# EAGLE design EnigmaMon (EAGLE 6.1)
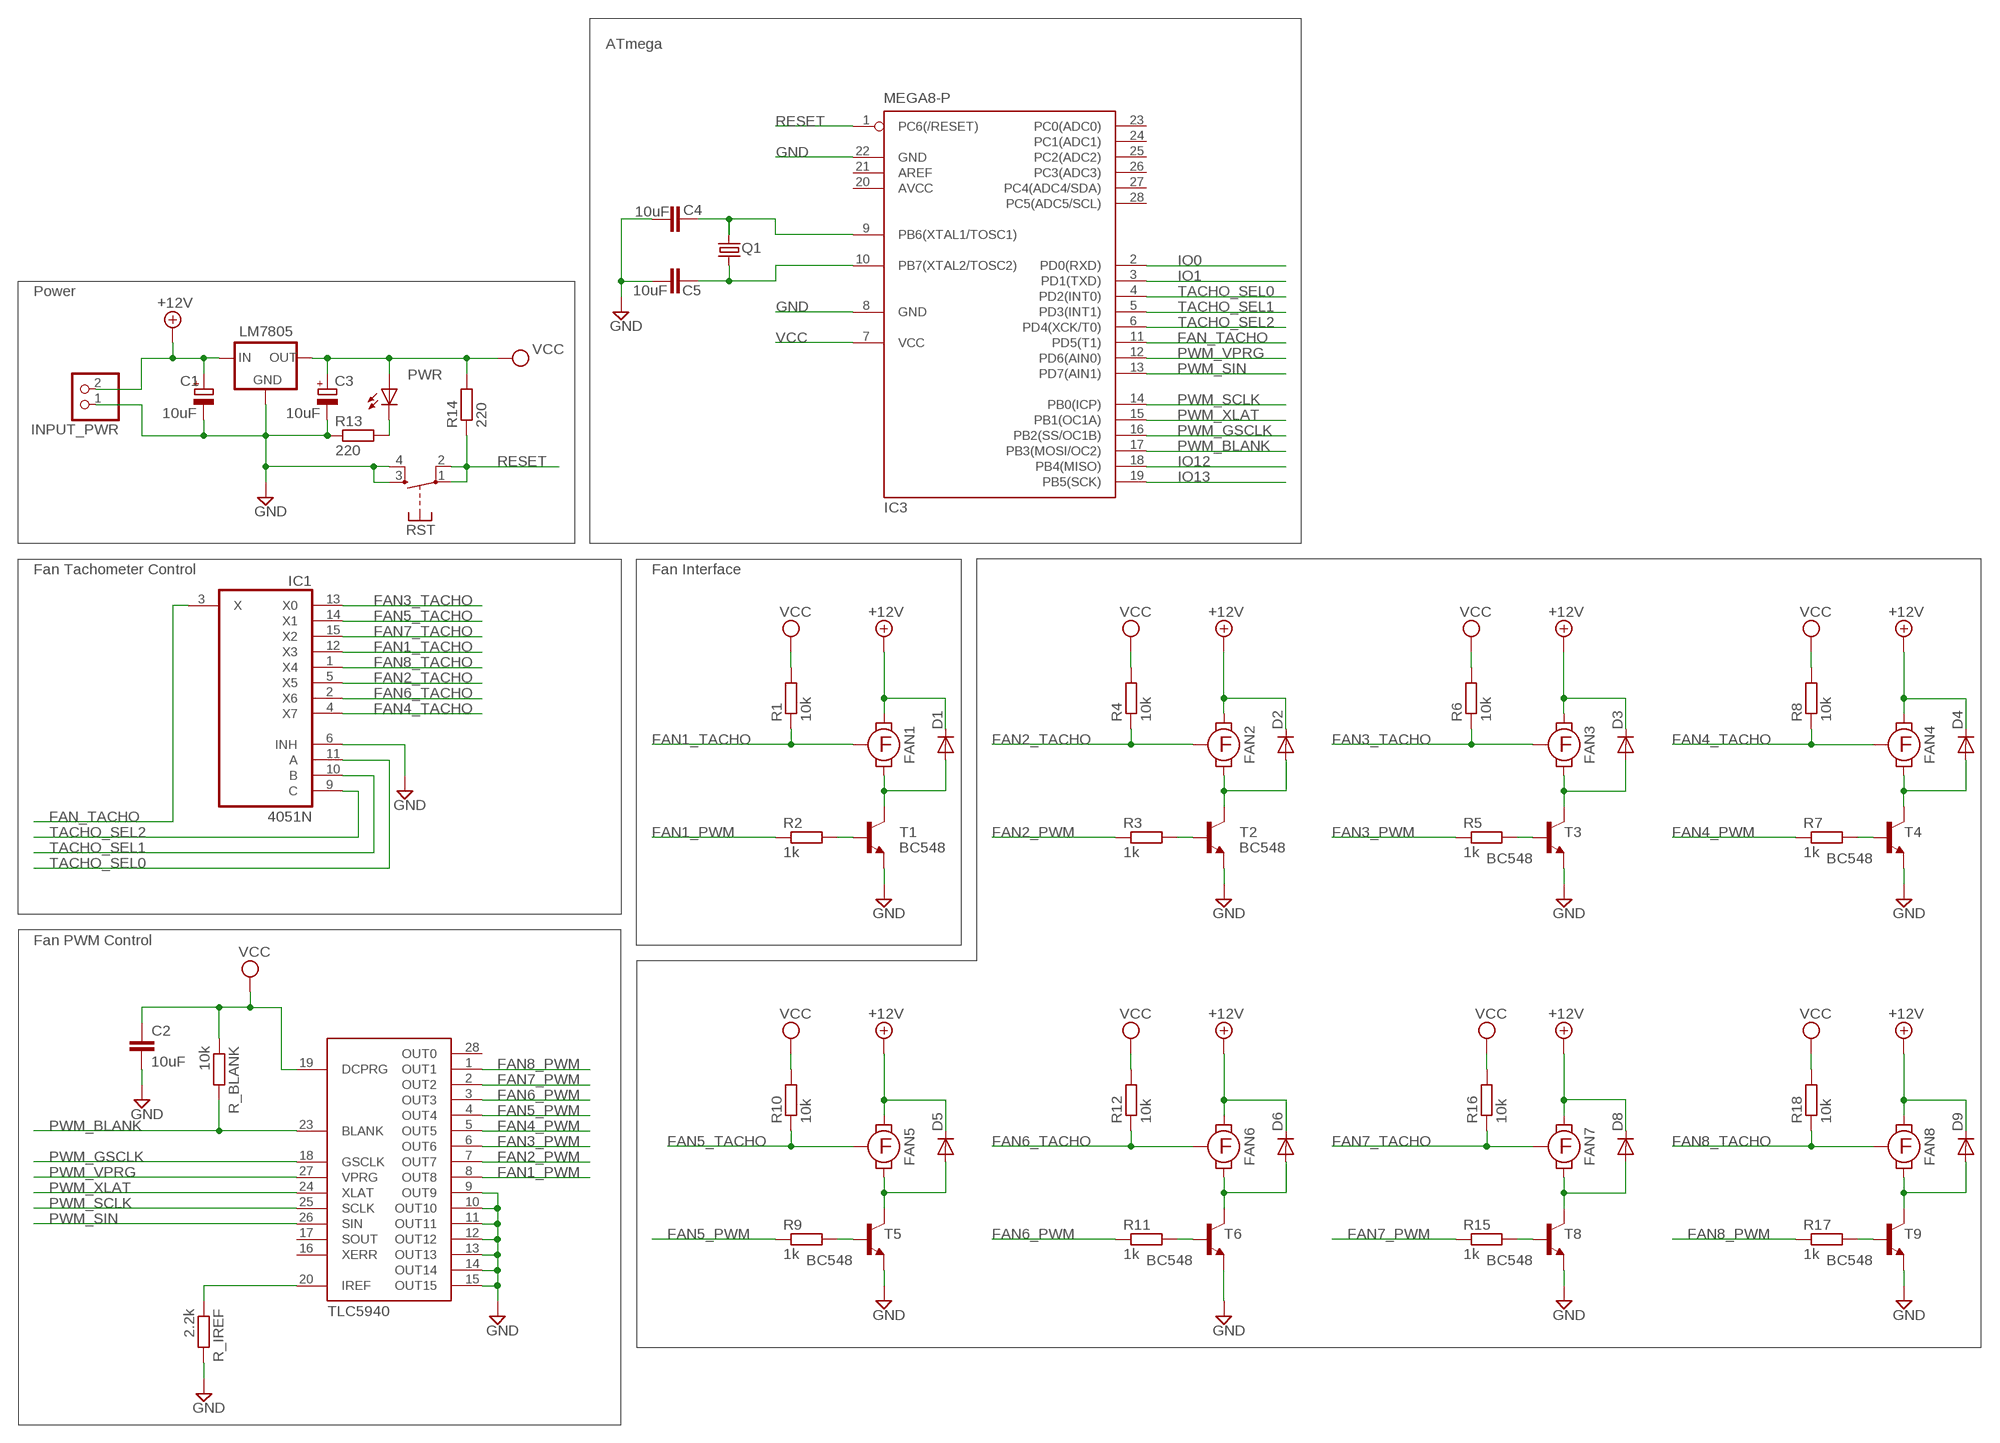
[diagram p0: schematic, sheet 1]

## Parts
C1  10uF  CPOL-EUE2.5-6  [E2,5-6]
C2  10uF  C-EU025-025X050  [C025-025X050]
C3  10uF  CPOL-EUE2.5-6  [E2,5-6]
C4  10uF  C-EU025-025X050  [C025-025X050]
C5  10uF  C-EU025-025X050  [C025-025X050]
D1  DIODE-D-5  [D-5]
D2  DIODE-D-5  [D-5]
D3  DIODE-D-5  [D-5]
D4  DIODE-D-5  [D-5]
D5  DIODE-D-5  [D-5]
D6  DIODE-D-5  [D-5]
D8  DIODE-D-5  [D-5]
D9  DIODE-D-5  [D-5]
FAN1  FAN  [FAN_HEADER]
FAN2  FAN  [FAN_HEADER]
FAN3  FAN  [FAN_HEADER]
FAN4  FAN  [FAN_HEADER]
FAN5  FAN  [FAN_HEADER]
FAN6  FAN  [FAN_HEADER]
FAN7  FAN  [FAN_HEADER]
FAN8  FAN  [FAN_HEADER]
IC1  4051N  [DIL16]
IC2  TLC5940  [DIL28-3]
IC3  MEGA8-P  [DIL28-3]
INPUT_PWR  PINHD-1X2  [1X02]
LM7805  78XXL  [78XXL]
PWR  LED3MM  [LED3MM]
Q1  CRYSTALHC49S  [HC49/S]
R1  10k  R-EU_0204/5  [0204/5]
R2  1k  R-EU_0204/5  [0204/5]
R3  1k  R-EU_0204/5  [0204/5]
R4  10k  R-EU_0204/5  [0204/5]
R5  1k  R-EU_0204/5  [0204/5]
R6  10k  R-EU_0204/5  [0204/5]
R7  1k  R-EU_0204/5  [0204/5]
R8  10k  R-EU_0204/5  [0204/5]
R9  1k  R-EU_0204/5  [0204/5]
R10  10k  R-EU_0204/5  [0204/5]
R11  1k  R-EU_0204/5  [0204/5]
R12  10k  R-EU_0204/5  [0204/5]
R13  220  R-EU_0204/7  [0204/7]
R14  220  R-EU_0204/7  [0204/7]
R15  1k  R-EU_0204/5  [0204/5]
R16  10k  R-EU_0204/5  [0204/5]
R17  1k  R-EU_0204/5  [0204/5]
R18  10k  R-EU_0204/5  [0204/5]
R_BLANK  10k  R-EU_0204/7  [0204/7]
R_IREF  2.2k  R-EU_0204/7  [0204/7]
RST  DTS6  [DTS6]
T1  BC548  BC547  [TO92]
T2  BC548  BC547  [TO92]
T3  BC548  BC547  [TO92]
T4  BC548  BC547  [TO92]
T5  BC548  BC547  [TO92]
T6  BC548  BC547  [TO92]
T8  BC548  BC547  [TO92]
T9  BC548  BC547  [TO92]

## Nets
+12V: C1.+ D1.C D2.C D3.C D4.C D5.C D6.C D8.C D9.C FAN1.VCC FAN2.VCC FAN3.VCC FAN4.VCC FAN5.VCC FAN6.VCC FAN7.VCC FAN8.VCC INPUT_PWR.2 LM7805.IN
FAN1_PWM: IC2.8(OUT8) R2.1
FAN1_TACHO: FAN1.TACHO IC1.12(X3) R1.1
FAN2_PWM: IC2.7(OUT7) R3.1
FAN2_TACHO: FAN2.TACHO IC1.5(X5) R4.1
FAN3_PWM: IC2.6(OUT6) R5.1
FAN3_TACHO: FAN3.TACHO IC1.13(X0) R6.1
FAN4_PWM: IC2.5(OUT5) R7.1
FAN4_TACHO: FAN4.TACHO IC1.4(X7) R8.1
FAN5_PWM: IC2.4(OUT4) R9.1
FAN5_TACHO: FAN5.TACHO IC1.14(X1) R10.1
FAN6_PWM: IC2.3(OUT3) R11.1
FAN6_TACHO: FAN6.TACHO IC1.2(X6) R12.1
FAN7_PWM: IC2.2(OUT2) R15.1
FAN7_TACHO: FAN7.TACHO IC1.15(X2) R16.1
FAN8_PWM: IC2.1(OUT1) R17.1
FAN8_TACHO: FAN8.TACHO IC1.1(X4) R18.1
FAN_TACHO: IC1.3(X) IC3.11(PD5(T1))
GND: C1.- C2.2 C3.- C4.1 C5.1 IC1.6(INH) IC2.9(OUT9) IC2.10(OUT10) IC2.11(OUT11) IC2.12(OUT12) IC2.13(OUT13) IC2.14(OUT14) IC2.15(OUT15) IC3.8(GND) IC3.22(GND) INPUT_PWR.1 LM7805.GND R13.1 R_IREF.2 RST.3(S) RST.4(S) T1.1(E) T2.1(E) T3.1(E) T4.1(E) T5.1(E) T6.1(E) T8.1(E) T9.1(E)
IO0: IC3.2(PD0(RXD))
IO1: IC3.3(PD1(TXD))
IO12: IC3.18(PB4(MISO))
IO13: IC3.19(PB5(SCK))
N$1: R3.2 T2.2(B)
N$2: R2.2 T1.2(B)
N$3: R5.2 T3.2(B)
N$4: R7.2 T4.2(B)
N$5: R9.2 T5.2(B)
N$6: R11.2 T6.2(B)
N$7: PWR.K(C) R13.2
N$8: R15.2 T8.2(B)
N$9: R17.2 T9.2(B)
N$10: IC2.20(IREF) R_IREF.1
N$11: C4.2 IC3.9(PB6(XTAL1/TOSC1)) Q1.2
N$12: C5.2 IC3.10(PB7(XTAL2/TOSC2)) Q1.1
N$13: D2.A FAN2.GND T2.3(C)
N$14: D3.A FAN3.GND T3.3(C)
N$15: D4.A FAN4.GND T4.3(C)
N$16: D1.A FAN1.GND T1.3(C)
N$17: D9.A FAN8.GND T9.3(C)
N$19: D8.A FAN7.GND T8.3(C)
N$20: D6.A FAN6.GND T6.3(C)
N$21: D5.A FAN5.GND T5.3(C)
PWM_BLANK: IC2.23(BLANK) IC3.17(PB3(MOSI/OC2)) R_BLANK.2
PWM_GSCLK: IC2.18(GSCLK) IC3.16(PB2(SS/OC1B))
PWM_SCLK: IC2.25(SCLK) IC3.14(PB0(ICP))
PWM_SIN: IC2.26(SIN) IC3.13(PD7(AIN1))
PWM_VPRG: IC2.27(VPRG) IC3.12(PD6(AIN0))
PWM_XLAT: IC2.24(XLAT) IC3.15(PB1(OC1A))
RESET: IC3.1(PC6(/RESET)) R14.1 RST.1(P) RST.2(P)
TACHO_SEL0: IC1.11(A) IC3.4(PD2(INT0))
TACHO_SEL1: IC1.10(B) IC3.5(PD3(INT1))
TACHO_SEL2: IC1.9(C) IC3.6(PD4(XCK/T0))
VCC: C2.1 C3.+ IC2.19(DCPRG) IC3.7(VCC) LM7805.OUT PWR.A R1.2 R4.2 R6.2 R8.2 R10.2 R12.2 R14.2 R16.2 R18.2 R_BLANK.1
Unconnected: IC2.16(XERR) IC2.17(SOUT) IC2.28(OUT0) IC3.21(AREF) IC3.23(PC0(ADC0)) IC3.24(PC1(ADC1)) IC3.25(PC2(ADC2)) IC3.26(PC3(ADC3)) IC3.27(PC4(ADC4/SDA)) IC3.28(PC5(ADC5/SCL))

## Notes on the sheet
- ATmega
- Power
- Fan Tachometer Control | Fan Interface
- Fan PWM Control

## Power pins joined to a net without a drawn wire
AVCC: IC3.20(AVCC)
GND: IC1.8(GND) IC2.22(GND)
VCC: IC1.16(VCC) IC2.21(VCC)
VEE: IC1.7(VEE)

## Library data of the parts
C1 C3 = rcl:CPOL-EU: POLARIZED CAPACITOR, European symbol
C2 C4 C5 = rcl:C-EU: CAPACITOR, European symbol
D1-D6 D8 D9 = diode:DIODE-: DIODE
FAN1-FAN8 = EnigmaMon:FAN
IC1 = 40xx:4051: 8-channel ANALOG MULTIPLEXER
IC2 = EnigmaMon:TLC5940: 16-channel LED driver with dot-correction and grayscale PWM control
IC3 = EnigmaMon:MEGA8-P: MICROCONTROLLER 8 Kbytes FLASH, 1 kbytes SRAM, 512 bytes EEPROM, USART, 4-channel 10 bit ADC, 2-channel 8 bit ADC Pin compatible with Atmega48, ATMega88, ATMega168 Source: avr.lbr; OC_FARNELL: unknown; OC_NEWARK: unknown
INPUT_PWR = EnigmaMon:PINHD-1X2: PIN HEADER
LM7805 = EnigmaMon:78XXL: VOLTAGE REGULATOR
PWR = EnigmaMon:LED: LED
Q1 = EnigmaMon:CRYSTAL: CRYSTAL; OC_FARNELL: 1667008; OC_NEWARK: unknown
R1-R18 R_BLANK R_IREF = rcl:R-EU_: RESISTOR, European symbol
RST = EnigmaMon:DTS6
T1-T6 T8 T9 = transistor:BC547: NPN TRANSISTOR

## Board
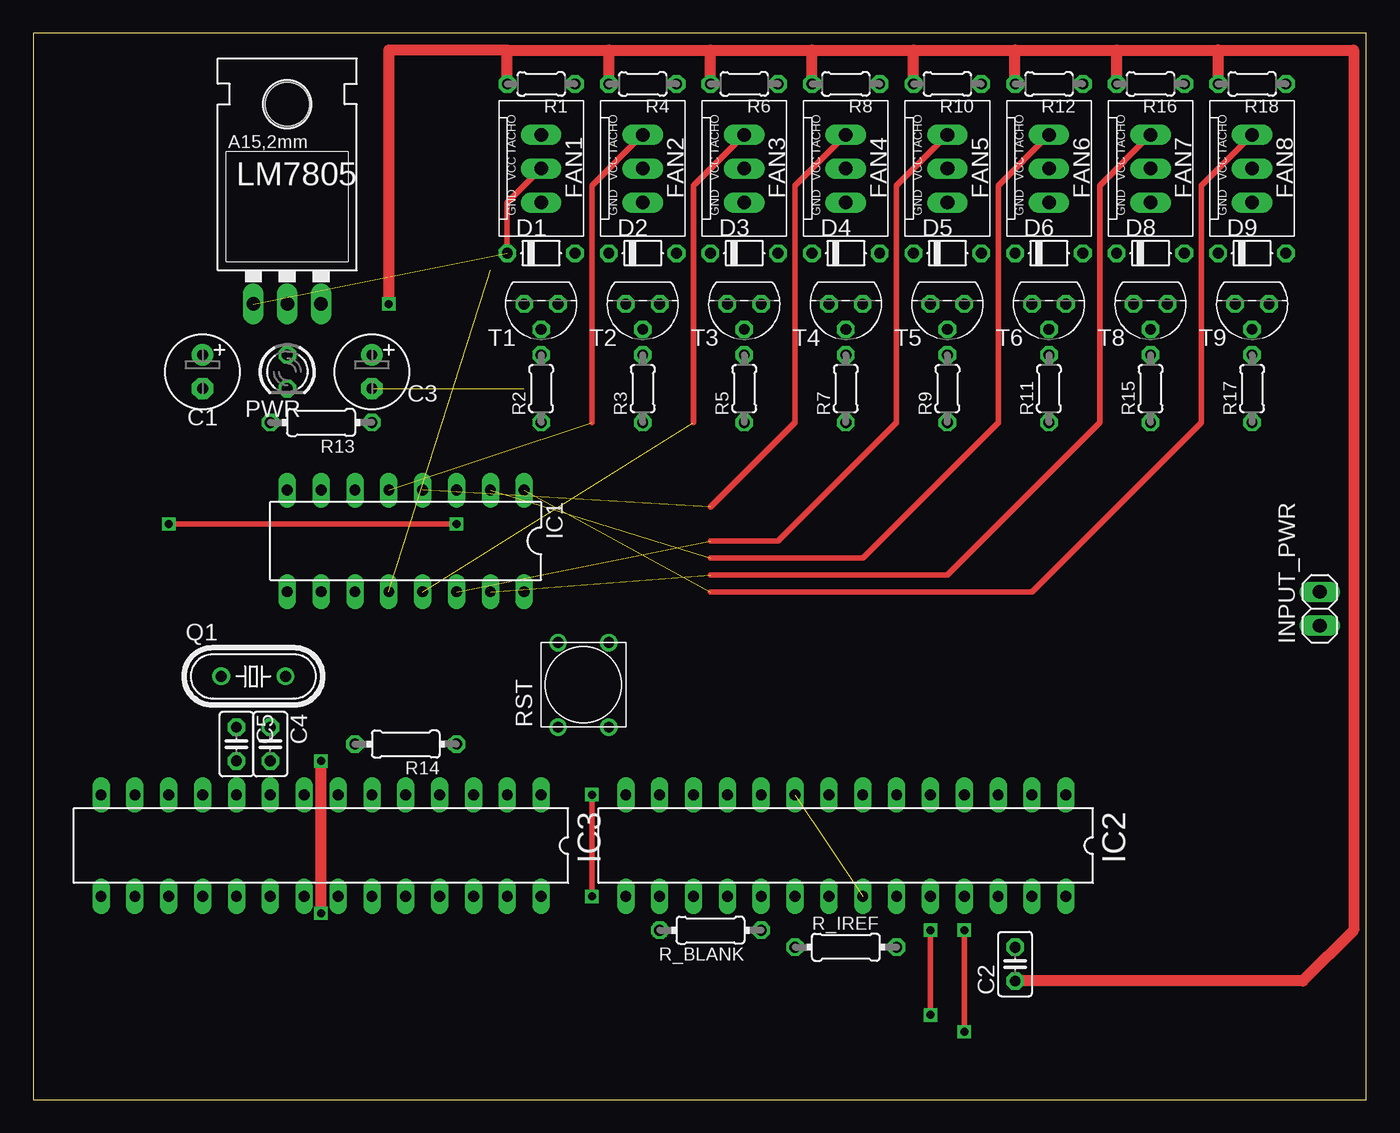
[diagram p1: board, top side]
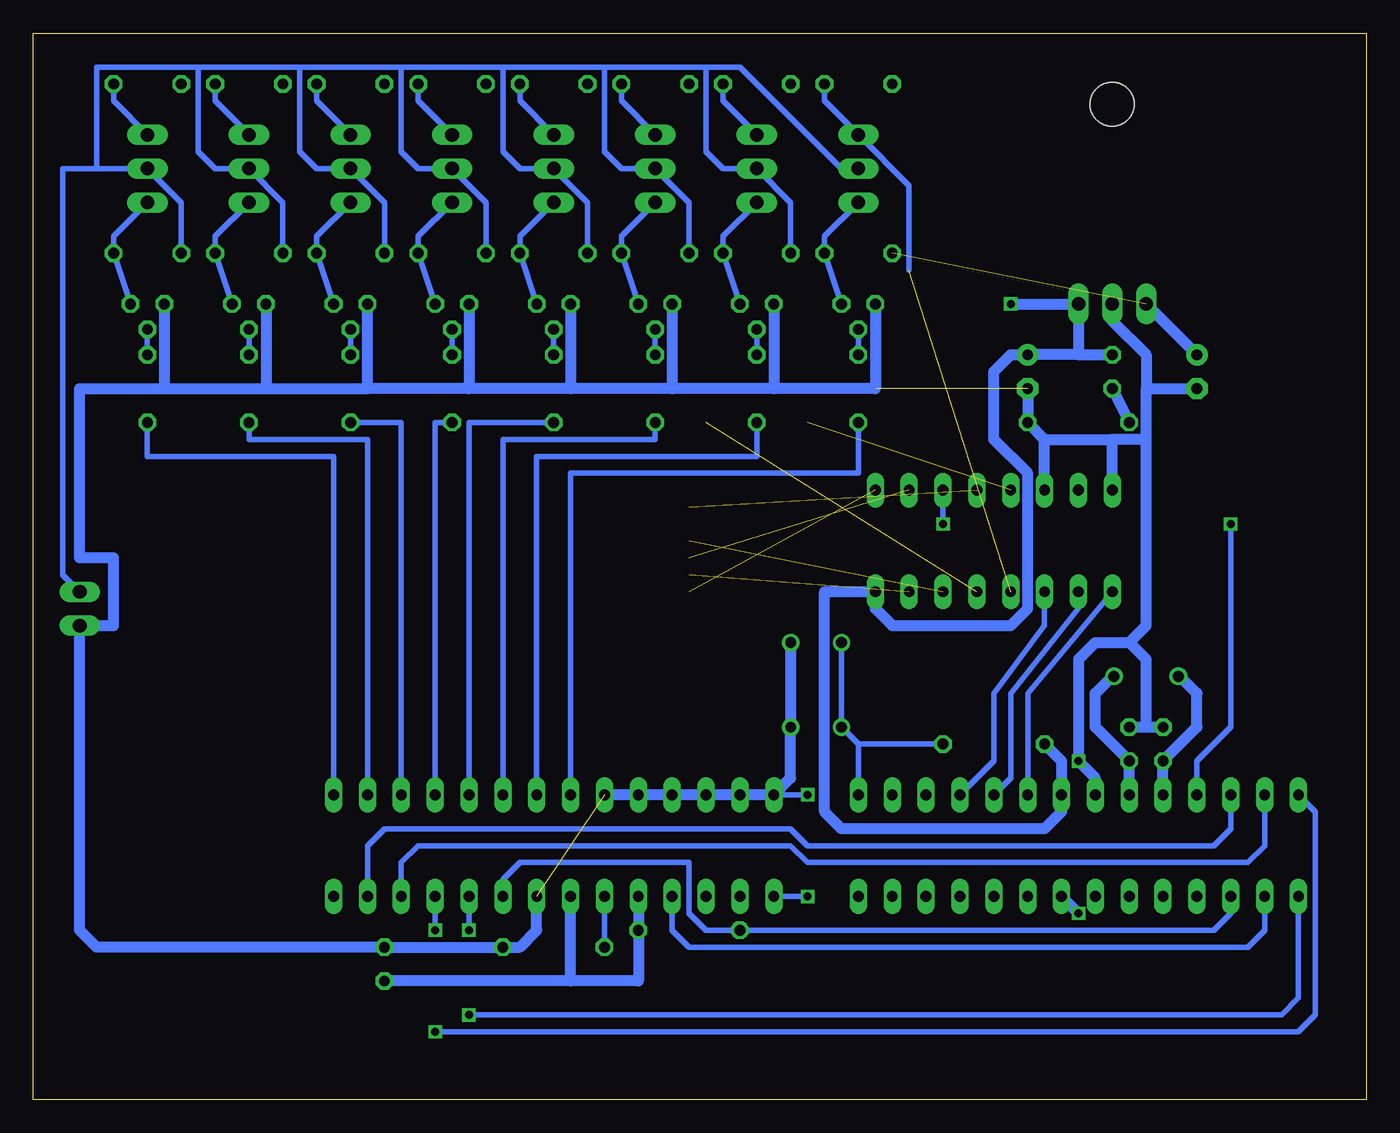
[diagram p2: board, bottom side, seen from below]

Size 100 x 80 mm. Coordinates in mm from the lower left corner, seen from the top.
Outline: 0,0 100,0 100,80 0,80 0,0
Copper layers (1*16): Top 0.035mm / dielectric 1.5mm / Bottom 0.035mm
Design rules: minimum track width 10mil, minimum drill 24mil, track to track 8mil, track to pad 8mil, pad to pad 8mil, via to via 8mil, smd to smd 8mil, copper to edge 40mil, drill to drill 8mil, minimum pad ring 10mil, minimum via ring 8mil, stop-mask expansion 4mil, vias tented up to drill 0mil, thermal gap 10mil

### Footprints (pad centres in the part's own frame; a part is rotated, then mirrored left to right if it is on the bottom)
E2,5-6 = drill 0.813 pad 1.6: + -1.27,0 | drill 0.813 pad 1.6 octagon: - 1.27,0
C025-025X050 = drill 0.813 octagon: 1 -1.27,0; 2 1.27,0
D-5 = drill 0.813 octagon: A 2.54,0; C -2.54,0
FAN_HEADER = drill 1.016 long: GND 2.54,0; TACHO -2.54,0; VCC 0,0
DIL16 = drill 0.813 long: 1 -8.89,-3.81; 2 -6.35,-3.81; 3 -3.81,-3.81; 4 -1.27,-3.81; 5 1.27,-3.81; 6 3.81,-3.81; 7 6.35,-3.81; 8 8.89,-3.81; 9 8.89,3.81; 10 6.35,3.81; 11 3.81,3.81; 12 1.27,3.81; 13 -1.27,3.81; 14 -3.81,3.81; 15 -6.35,3.81; 16 -8.89,3.81
DIL28-3 = drill 0.813 long: 1 -16.51,-3.81; 2 -13.97,-3.81; 3 -11.43,-3.81; 4 -8.89,-3.81; 5 -6.35,-3.81; 6 -3.81,-3.81; 7 -1.27,-3.81; 8 1.27,-3.81; 9 3.81,-3.81; 10 6.35,-3.81; 11 8.89,-3.81; 12 11.43,-3.81; 13 13.97,-3.81; 14 16.51,-3.81; 15 16.51,3.81; 16 13.97,3.81; 17 11.43,3.81; 18 8.89,3.81; 19 6.35,3.81; 20 3.81,3.81; 21 1.27,3.81; 22 -1.27,3.81; 23 -3.81,3.81; 24 -6.35,3.81; 25 -8.89,3.81; 26 -11.43,3.81; 27 -13.97,3.81; 28 -16.51,3.81
1X02 = drill 1.016 long: 1 -1.27,0; 2 1.27,0
78XXL = drill 1.016 long: GND 0,-3.81; IN -2.54,-3.81; OUT 2.54,-3.81 | hole 3.302: 0,11.176
LED3MM = drill 0.813 octagon: A -1.27,0; K 1.27,0
HC49/S = drill 0.813: 1 -2.413,0; 2 2.413,0
0204/5 = drill 0.813 octagon: 1 -2.54,0; 2 2.54,0
0204/7 = drill 0.813 octagon: 1 -3.81,0; 2 3.81,0
DTS6 = drill 0.8: 1 -2.54,2.54; 2 3.81,2.54; 3 -2.54,-1.27; 4 3.81,-1.27
TO92 = drill 0.813 octagon: 1 1.27,0; 2 0,1.905; 3 -1.27,0

### Placement (x,y rotation side)
C1  12.7,54.61 270 top
C2  73.66,10.16 90 top
C3  25.4,54.61 270 top
C4  17.78,26.67 270 top
C5  15.24,26.67 270 top
D1  38.1,63.5 0 top
D2  45.72,63.5 0 top
D3  53.34,63.5 0 top
D4  60.96,63.5 0 top
D5  68.58,63.5 0 top
D6  76.2,63.5 0 top
D8  83.82,63.5 0 top
D9  91.44,63.5 0 top
FAN1  38.1,69.85 270 top
FAN2  45.72,69.85 270 top
FAN3  53.34,69.85 270 top
FAN4  60.96,69.85 270 top
FAN5  68.58,69.85 270 top
FAN6  76.2,69.85 270 top
FAN7  83.82,69.85 270 top
FAN8  91.44,69.85 270 top
IC1  27.94,41.91 180 top
IC2  60.96,19.05 180 top
IC3  21.59,19.05 180 top
INPUT_PWR  96.52,36.83 90 top
LM7805  19.05,63.5 0 top
PWR  19.05,54.61 270 top
Q1  16.51,31.75 0 top
R1  38.1,76.2 180 top
R2  38.1,53.34 90 top
R3  45.72,53.34 90 top
R4  45.72,76.2 180 top
R5  53.34,53.34 90 top
R6  53.34,76.2 180 top
R7  60.96,53.34 90 top
R8  60.96,76.2 180 top
R9  68.58,53.34 90 top
R10  68.58,76.2 180 top
R11  76.2,53.34 90 top
R12  76.2,76.2 180 top
R13  21.59,50.8 180 top
R14  27.94,26.67 180 top
R15  83.82,53.34 90 top
R16  83.82,76.2 180 top
R17  91.44,53.34 90 top
R18  91.44,76.2 180 top
R_BLANK  50.8,12.7 180 top
R_IREF  60.96,11.43 0 top
RST  41.91,30.48 90 top
T1  38.1,59.69 180 top
T2  45.72,59.69 180 top
T3  53.34,59.69 180 top
T4  60.96,59.69 180 top
T5  68.58,59.69 180 top
T6  76.2,59.69 180 top
T8  83.82,59.69 180 top
T9  91.44,59.69 180 top

### Tracks (layer width: path | path; a pad name or v marks a point on that pad's centre or on a via)
+12V  (1 unrouted)
  Top 0.406: D1.C 35.56,67.31 FAN1.VCC
  Bottom 0.406: D9.C 88.9,67.31 FAN8.VCC 95.25,69.85 | D8.C 81.28,67.31 FAN7.VCC 86.36,69.85 87.63,71.12 87.63,77.47 | D6.C 73.66,67.31 FAN6.VCC 78.74,69.85 80.01,71.12 80.01,77.47 | D5.C 66.04,67.31 FAN5.VCC 71.12,69.85 72.39,71.12 72.39,77.47 | D4.C 58.42,67.31 FAN4.VCC 63.5,69.85 64.77,71.12 64.77,77.47 | D3.C 50.8,67.31 FAN3.VCC 55.88,69.85 57.15,71.12 57.15,77.47 | D2.C 43.18,67.31 FAN2.VCC 48.26,69.85 49.53,71.12 49.53,77.47 | 95.25,69.85 95.25,77.47 87.63,77.47 | 80.01,77.47 87.63,77.47 | 72.39,77.47 80.01,77.47 | 64.77,77.47 72.39,77.47 | 57.15,77.47 64.77,77.47 | 49.53,77.47 57.15,77.47 | FAN1.VCC 39.37,69.85 46.99,77.47 49.53,77.47 | INPUT_PWR.2 97.79,39.37 97.79,69.85 95.25,69.85
  Bottom 0.813: LM7805.IN C1.+
FAN1_PWM
  Bottom 0.406: R2.1 38.1,46.99 59.69,46.99 IC2.8
FAN1_TACHO  (1 unrouted)
  Bottom 0.406: R1.1 40.64,74.93 FAN1.TACHO 34.29,68.58 34.29,62.23
FAN2_PWM
  Bottom 0.406: R3.1 45.72,48.26 62.23,48.26 IC2.7
FAN2_TACHO  (1 unrouted)
  Top 0.406: FAN2.TACHO 41.91,68.58 41.91,50.8
  Bottom 0.406: R4.1 48.26,74.93 FAN2.TACHO
FAN3_PWM
  Bottom 0.406: R5.1 53.34,49.53 64.77,49.53 IC2.6
FAN3_TACHO  (1 unrouted)
  Top 0.406: FAN3.TACHO 49.53,68.58 49.53,50.8
  Bottom 0.406: R6.1 55.88,74.93 FAN3.TACHO
FAN4_PWM
  Bottom 0.406: R7.1 67.31,50.8 IC2.5
FAN4_TACHO  (1 unrouted)
  Top 0.406: FAN4.TACHO 57.15,68.58 57.15,50.8 50.8,44.45
  Bottom 0.406: R8.1 63.5,74.93 FAN4.TACHO
FAN5_PWM
  Bottom 0.406: R9.1 69.85,50.8 IC2.4
FAN5_TACHO  (1 unrouted)
  Top 0.406: FAN5.TACHO 64.77,68.58 64.77,50.8 55.88,41.91 50.8,41.91
  Bottom 0.406: R10.1 71.12,74.93 FAN5.TACHO
FAN6_PWM
  Bottom 0.406: R11.1 72.39,50.8 IC2.3
FAN6_TACHO  (1 unrouted)
  Top 0.406: FAN6.TACHO 72.39,68.58 72.39,50.8 62.23,40.64 50.8,40.64
  Bottom 0.406: R12.1 78.74,74.93 FAN6.TACHO
FAN7_PWM
  Bottom 0.406: R15.1 83.82,49.53 74.93,49.53 IC2.2
FAN7_TACHO  (1 unrouted)
  Top 0.406: FAN7.TACHO 80.01,68.58 80.01,50.8 68.58,39.37 50.8,39.37
  Bottom 0.406: R16.1 86.36,74.93 FAN7.TACHO
FAN8_PWM
  Bottom 0.406: R17.1 91.44,48.26 77.47,48.26 IC2.1
FAN8_TACHO  (1 unrouted)
  Top 0.406: FAN8.TACHO 87.63,68.58 87.63,50.8 74.93,38.1 50.8,38.1
  Bottom 0.406: R18.1 93.98,74.93 FAN8.TACHO
FAN_TACHO  (via drill 0.6)
  Top 0.406: v31.75,43.18 v10.16,43.18
  Bottom 0.406: IC3.11 12.7,25.4 10.16,27.94 v10.16,43.18 | v31.75,43.18 IC1.3
GND  (via drill 0.6)  (2 unrouted)
  Top 0.406: v41.91,15.24 v41.91,22.86
  Top 0.813: v21.59,13.97 v21.59,25.4
  Bottom 0.406: IC2.15 v41.91,15.24 | v41.91,22.86 IC2.14
  Bottom 0.813: T1.1 36.83,53.34 44.45,53.34 | 44.45,53.34 52.07,53.34 | 52.07,53.34 59.69,53.34 | 59.69,53.34 67.31,53.34 | 67.31,53.34 74.93,53.34 | 74.93,53.34 T6.1 | T2.1 44.45,53.34 | T4.1 59.69,53.34 | T5.1 67.31,53.34 | C3.- R13.1 24.13,49.53 | 24.13,49.53 19.05,49.53 | 16.51,49.53 16.51,53.34 | 90.17,53.34 82.55,53.34 | 82.55,53.34 74.93,53.34 | T8.1 82.55,53.34 | T9.1 90.17,53.34 | 90.17,53.34 96.52,53.34 96.52,40.64 93.98,40.64 93.98,35.56 INPUT_PWR.1 96.52,12.7 95.25,11.43 C2.2 R_IREF.2 63.5,11.43 62.23,12.7 IC2.22 | LM7805.GND 19.05,58.42 16.51,55.88 16.51,53.34 | 16.51,53.34 C1.- | IC2.9 IC2.10 IC2.11 IC2.12 IC2.13 IC2.14 43.18,24.13 RST.3 RST.4 | IC1.8 19.05,49.53 | IC3.22 v21.59,13.97 | 16.51,27.94 C5.1 | C4.1 16.51,27.94 | 16.51,27.94 16.51,33.02 17.78,34.29 | IC3.8 20.32,24.13 v21.59,25.4 21.59,33.02 20.32,34.29 17.78,34.29 | IC1.6 24.13,49.53 | 17.78,34.29 16.51,35.56 16.51,49.53 | 16.51,49.53 19.05,49.53 | T3.1 52.07,53.34
N$1
  Bottom 0.406: T2.2 R3.2
N$2
  Bottom 0.406: T1.2 R2.2
N$3
  Bottom 0.406: R5.2 T3.2
N$4
  Bottom 0.406: R7.2 T4.2
N$5
  Bottom 0.406: T5.2 R9.2
N$6
  Bottom 0.406: T6.2 R11.2
N$7
  Bottom 0.813: PWR.K R13.2
N$8
  Bottom 0.406: T8.2 R15.2
N$9
  Bottom 0.406: T9.2 R17.2
N$10
  Bottom 0.406: R_IREF.1 IC2.20
N$11
  Bottom 0.813: IC3.9 C4.2 20.32,27.94 20.32,30.48 19.05,31.75 Q1.2
N$12
  Bottom 0.813: IC3.10 C5.2 12.7,27.94 12.7,30.48 13.97,31.75 Q1.1
N$13
  Bottom 0.406: FAN2.GND 48.26,64.77 D2.A T2.3
N$14
  Bottom 0.406: FAN3.GND 55.88,64.77 D3.A T3.3
N$15
  Bottom 0.406: FAN4.GND 63.5,64.77 D4.A T4.3
N$16
  Bottom 0.406: FAN1.GND 40.64,64.77 D1.A T1.3
N$17
  Bottom 0.406: FAN8.GND 93.98,64.77 D9.A T9.3
N$19
  Bottom 0.406: FAN7.GND 86.36,64.77 D8.A T8.3
N$20
  Bottom 0.406: FAN6.GND 78.74,64.77 D6.A T6.3
N$21
  Bottom 0.406: FAN5.GND 71.12,64.77 D5.A T5.3
PWM_BLANK  (via drill 0.6)
  Bottom 0.406: IC3.17 10.16,13.97 11.43,12.7 R_BLANK.2 49.53,12.7 50.8,13.97 50.8,17.78 63.5,17.78 64.77,16.51 IC2.23
  other vias: 46.99,12.7 46.99,12.7
PWM_GSCLK
  Bottom 0.406: IC3.16 7.62,12.7 8.89,11.43 50.8,11.43 52.07,12.7 IC2.18
PWM_SCLK  (via drill 0.6)
  Top 0.406: v69.85,12.7 v69.85,5.08
  Bottom 0.406: v69.85,5.08 5.08,5.08 3.81,6.35 3.81,21.59 IC3.14 | IC2.25 v69.85,12.7
PWM_SIN
  Bottom 0.406: IC3.13 7.62,19.05 8.89,17.78 41.91,17.78 43.18,19.05 71.12,19.05 72.39,17.78 IC2.26
PWM_VPRG
  Bottom 0.406: IC3.12 10.16,20.32 11.43,19.05 41.91,19.05 43.18,20.32 73.66,20.32 74.93,19.05 IC2.27
PWM_XLAT  (via drill 0.6)
  Top 0.406: v67.31,12.7 v67.31,6.35
  Bottom 0.406: IC2.24 v67.31,12.7 | v67.31,6.35 6.35,6.35 5.08,7.62 IC3.15
RESET
  Bottom 0.406: 38.1,26.67 RST.1 RST.2 | R14.1 38.1,26.67 | 38.1,26.67 IC3.1
TACHO_SEL0
  Bottom 0.406: IC1.11 24.13,35.56 27.94,30.48 27.94,25.4 IC3.4
TACHO_SEL1
  Bottom 0.406: IC1.10 21.59,36.83 26.67,30.48 26.67,24.13 IC3.5
TACHO_SEL2
  Bottom 0.406: IC1.9 25.4,30.48 IC3.6
VCC  (via drill 0.6)
  Top 0.813: 35.56,78.74 43.18,78.74 | R4.2 43.18,78.74 | 43.18,78.74 50.8,78.74 | R6.2 50.8,78.74 | 50.8,78.74 58.42,78.74 | R8.2 58.42,78.74 | 58.42,78.74 66.04,78.74 | R10.2 66.04,78.74 | 66.04,78.74 73.66,78.74 | R12.2 73.66,78.74 | 73.66,78.74 81.28,78.74 | R16.2 81.28,78.74 | 81.28,78.74 88.9,78.74 | R18.2 88.9,78.74 | 88.9,78.74 99.06,78.74 99.06,12.7 95.25,8.89 C2.1 | R1.2 35.56,78.74 | 35.56,78.74 26.67,78.74 v26.67,59.69
  Bottom 0.813: IC2.19 R_BLANK.1 54.61,8.89 59.69,8.89 | 59.69,8.89 C2.1 | 59.69,8.89 IC2.21 | 21.59,55.88 LM7805.OUT v26.67,59.69 | 21.59,55.88 C3.+ 26.67,55.88 27.94,54.61 27.94,49.53 25.4,46.99 25.4,36.83 26.67,35.56 35.56,35.56 36.83,36.83 IC1.16 40.64,38.1 40.64,21.59 39.37,20.32 24.13,20.32 22.86,21.59 IC3.7 22.86,25.4 R14.2 | 21.59,55.88 PWR.A